# EAGLE schematic etesters001 (EAGLE 9.6.2)
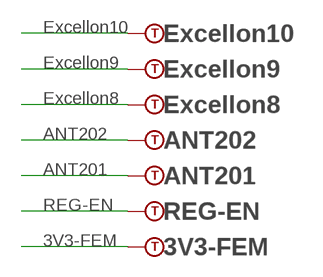
[diagram p0: schematic, sheet 1]

## Parts
3V3-FEM  TESPOINT-SMD1.5MM  [TESTPOINT-1.5MM]
ANT201  MLA-DN038  TESPOINT-SMD1.5MM  [TESTPOINT-1.5MM]
ANT202  MLA-DN038-MIRROR  TESPOINT-SMD1.5MM  [TESTPOINT-1.5MM]
Excellon8  TESPOINT-SMD1.5MM  [TESTPOINT-1.5MM]
Excellon9  TESPOINT-SMD1.5MM  [TESTPOINT-1.5MM]
Excellon10  TESPOINT-SMD1.5MM  [TESTPOINT-1.5MM]
REG-EN  TESPOINT-SMD1.5MM  [TESTPOINT-1.5MM]

## Nets
3V3-FEM: 3V3-FEM.1
ANT201: ANT201.1
ANT202: ANT202.1
Excellon8: Excellon8.1
Excellon9: Excellon9.1
Excellon10: Excellon10.1
REG-EN: REG-EN.1

## Library data of the parts
3V3-FEM ANT201 ANT202 Excellon8-Excellon10 REG-EN = Generics_stg:TESPOINT